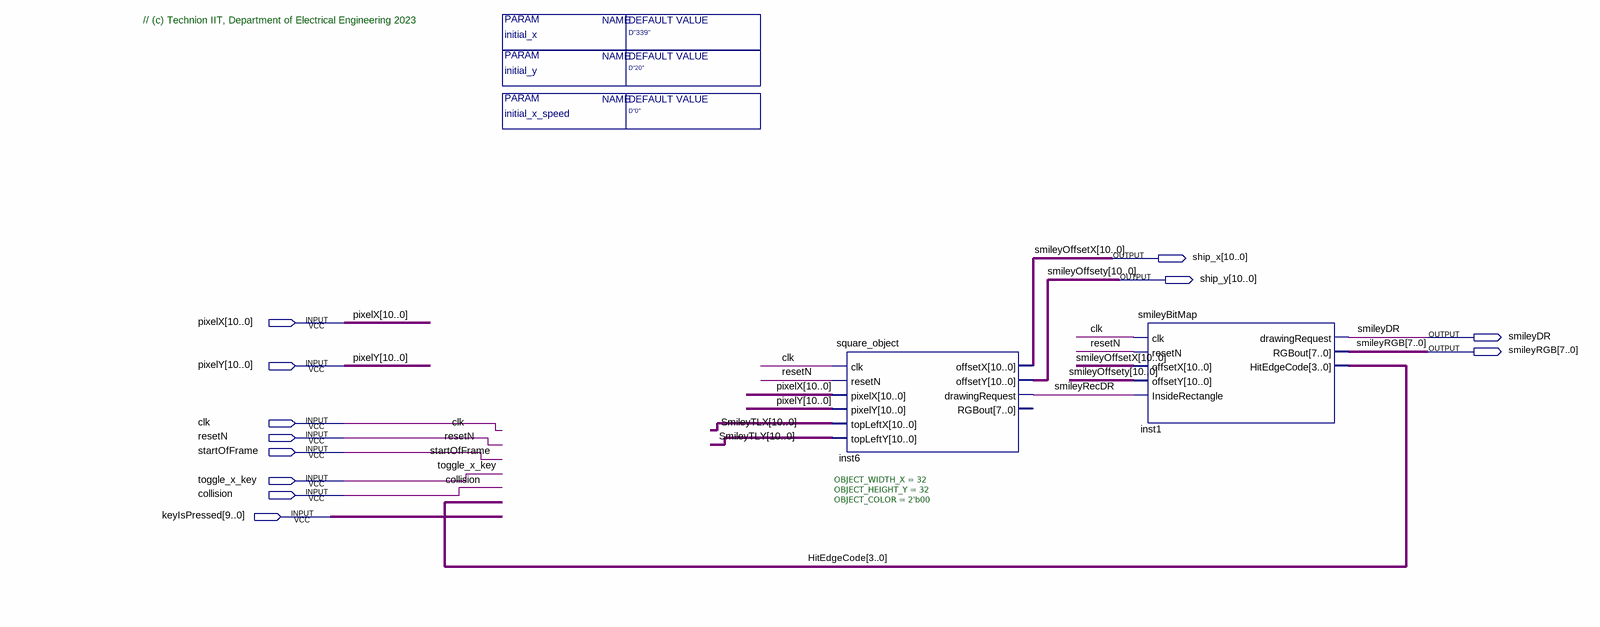
[diagram p0: schematic sheet]
// Quartus schematic Smiley_Block_T.bdf as structural Verilog: 2 symbols, 12 pins
module Smiley_Block_T #(parameter initial_x = "D\"339\"", parameter initial_y = "D\"20\"", parameter initial_x_speed = "D\"0\"") (
  input  [10:0] pixelX,
  input  [10:0] pixelY,
  input  clk,
  input  resetN,
  input  startOfFrame,
  input  toggle_x_key,
  input  collision,
  input  [9:0] keyIsPressed,
  output [10:0] ship_x,
  output [10:0] ship_y,
  output smileyDR,
  output [7:0] smileyRGB
);

  wire smileyRecDR;
  wire [3:0] HitEdgeCode;
  wire [10:0] SmileyTLX, SmileyTLY;

  square_object #(.OBJECT_WIDTH_X(32), .OBJECT_HEIGHT_Y(32), .OBJECT_COLOR(2'b00)) inst6 (
    .clk(clk), .resetN(resetN), .pixelX(pixelX), .pixelY(pixelY), .topLeftX(SmileyTLX), .topLeftY(SmileyTLY),
    .offsetX(ship_x), .offsetY(ship_y), .drawingRequest(smileyRecDR));  // open: RGBout
  smileyBitMap inst1 (
    .clk(clk), .resetN(resetN), .offsetX(ship_x), .offsetY(ship_y), .InsideRectangle(smileyRecDR),
    .drawingRequest(smileyDR), .RGBout(smileyRGB), .HitEdgeCode(HitEdgeCode));

  // Other names for the same wires on the sheet: smileyOffsetX[10:0] = ship_x; smileyOffsety[10:0] = ship_y

  // Notes on the sheet:
  //   // (c) Technion IIT, Department of Electrical Engineering 2023
endmodule
